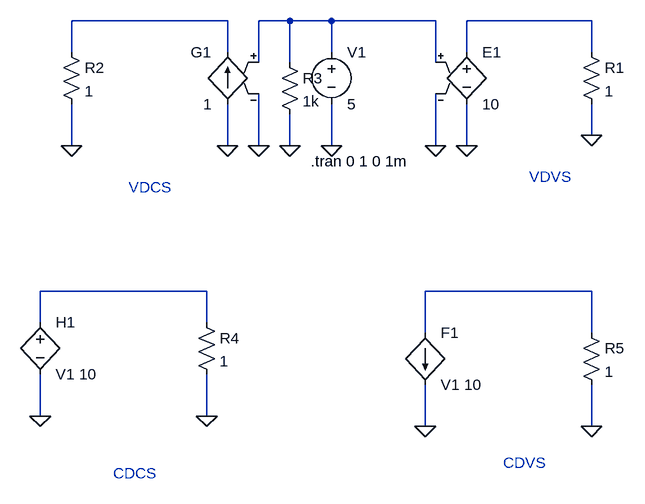
[diagram p0: schematic Basic VDVS, VDCS, CDVS, CDCS.asc]
Basic VDVS, VDCS, CDVS, CDCS.asc, the LTspice schematic file:
Version 4.1
SHEET 1 880 824
WIRE -144 112 -384 112
WIRE -48 112 -96 112
WIRE 16 112 -48 112
WIRE 176 112 16 112
WIRE 416 112 224 112
WIRE -384 160 -384 112
WIRE -144 160 -144 112
WIRE 16 160 16 112
WIRE 224 160 224 112
WIRE 416 160 416 112
WIRE -96 176 -96 112
WIRE -48 176 -48 112
WIRE 176 176 176 112
WIRE 416 288 416 240
WIRE -384 304 -384 240
WIRE -144 304 -144 240
WIRE -96 304 -96 224
WIRE -48 304 -48 256
WIRE 16 304 16 240
WIRE 176 304 176 224
WIRE 224 304 224 240
WIRE -176 528 -432 528
WIRE 416 528 160 528
WIRE -432 576 -432 528
WIRE -176 576 -176 528
WIRE 160 592 160 528
WIRE 416 592 416 528
WIRE -432 720 -432 656
WIRE -176 720 -176 656
WIRE 160 736 160 672
WIRE 416 736 416 672
FLAG 16 304 0
FLAG 224 304 0
FLAG 416 288 0
FLAG 176 304 0
FLAG -384 304 0
FLAG -96 304 0
FLAG -144 304 0
FLAG -432 720 0
FLAG -176 720 0
FLAG -48 304 0
FLAG 416 736 0
FLAG 160 736 0
SYMBOL voltage 16 144 R0
SYMATTR InstName V1
SYMATTR Value 5
SYMBOL e 224 144 R0
SYMATTR InstName E1
SYMATTR Value 10
SYMBOL res 400 144 R0
SYMATTR InstName R1
SYMATTR Value 1
SYMBOL g -144 144 M0
SYMATTR InstName G1
SYMATTR Value 1
SYMBOL res -400 144 R0
SYMATTR InstName R2
SYMATTR Value 1
SYMBOL h -432 560 R0
SYMATTR InstName H1
SYMATTR Value V1 10
SYMBOL res -192 560 R0
SYMATTR InstName R4
SYMATTR Value 1
SYMBOL res -64 160 R0
SYMATTR InstName R3
SYMATTR Value 1k
SYMBOL res 400 576 R0
SYMATTR InstName R5
SYMATTR Value 1
SYMBOL f 160 592 R0
SYMATTR InstName F1
SYMATTR Value V1 10
TEXT -16 328 Left 2 !.tran 0 1 0 1m
TEXT -296 368 Left 2 ;VDCS
TEXT 320 352 Left 2 ;VDVS
TEXT 280 792 Left 2 ;CDVS
TEXT -320 808 Left 2 ;CDCS

The netlist it stands for:
* Basic VDVS, VDCS, CDVS, CDCS.asc
V1 N002 0 5
E1 N003 0 N002 0 10
R1 N003 0 1
G1 0 N001 N002 0 1
R2 N001 0 1
H1 N004 0 V1 10
R4 N004 0 1
R3 N002 0 1k
R5 N005 0 1
F1 N005 0 V1 10
.tran 0 1 0 1m
* VDCS
* VDVS
* CDVS
* CDCS
.backanno
.end